# EAGLE design BMS MiniCAN Board Thermistor (EAGLE 7.6.0)
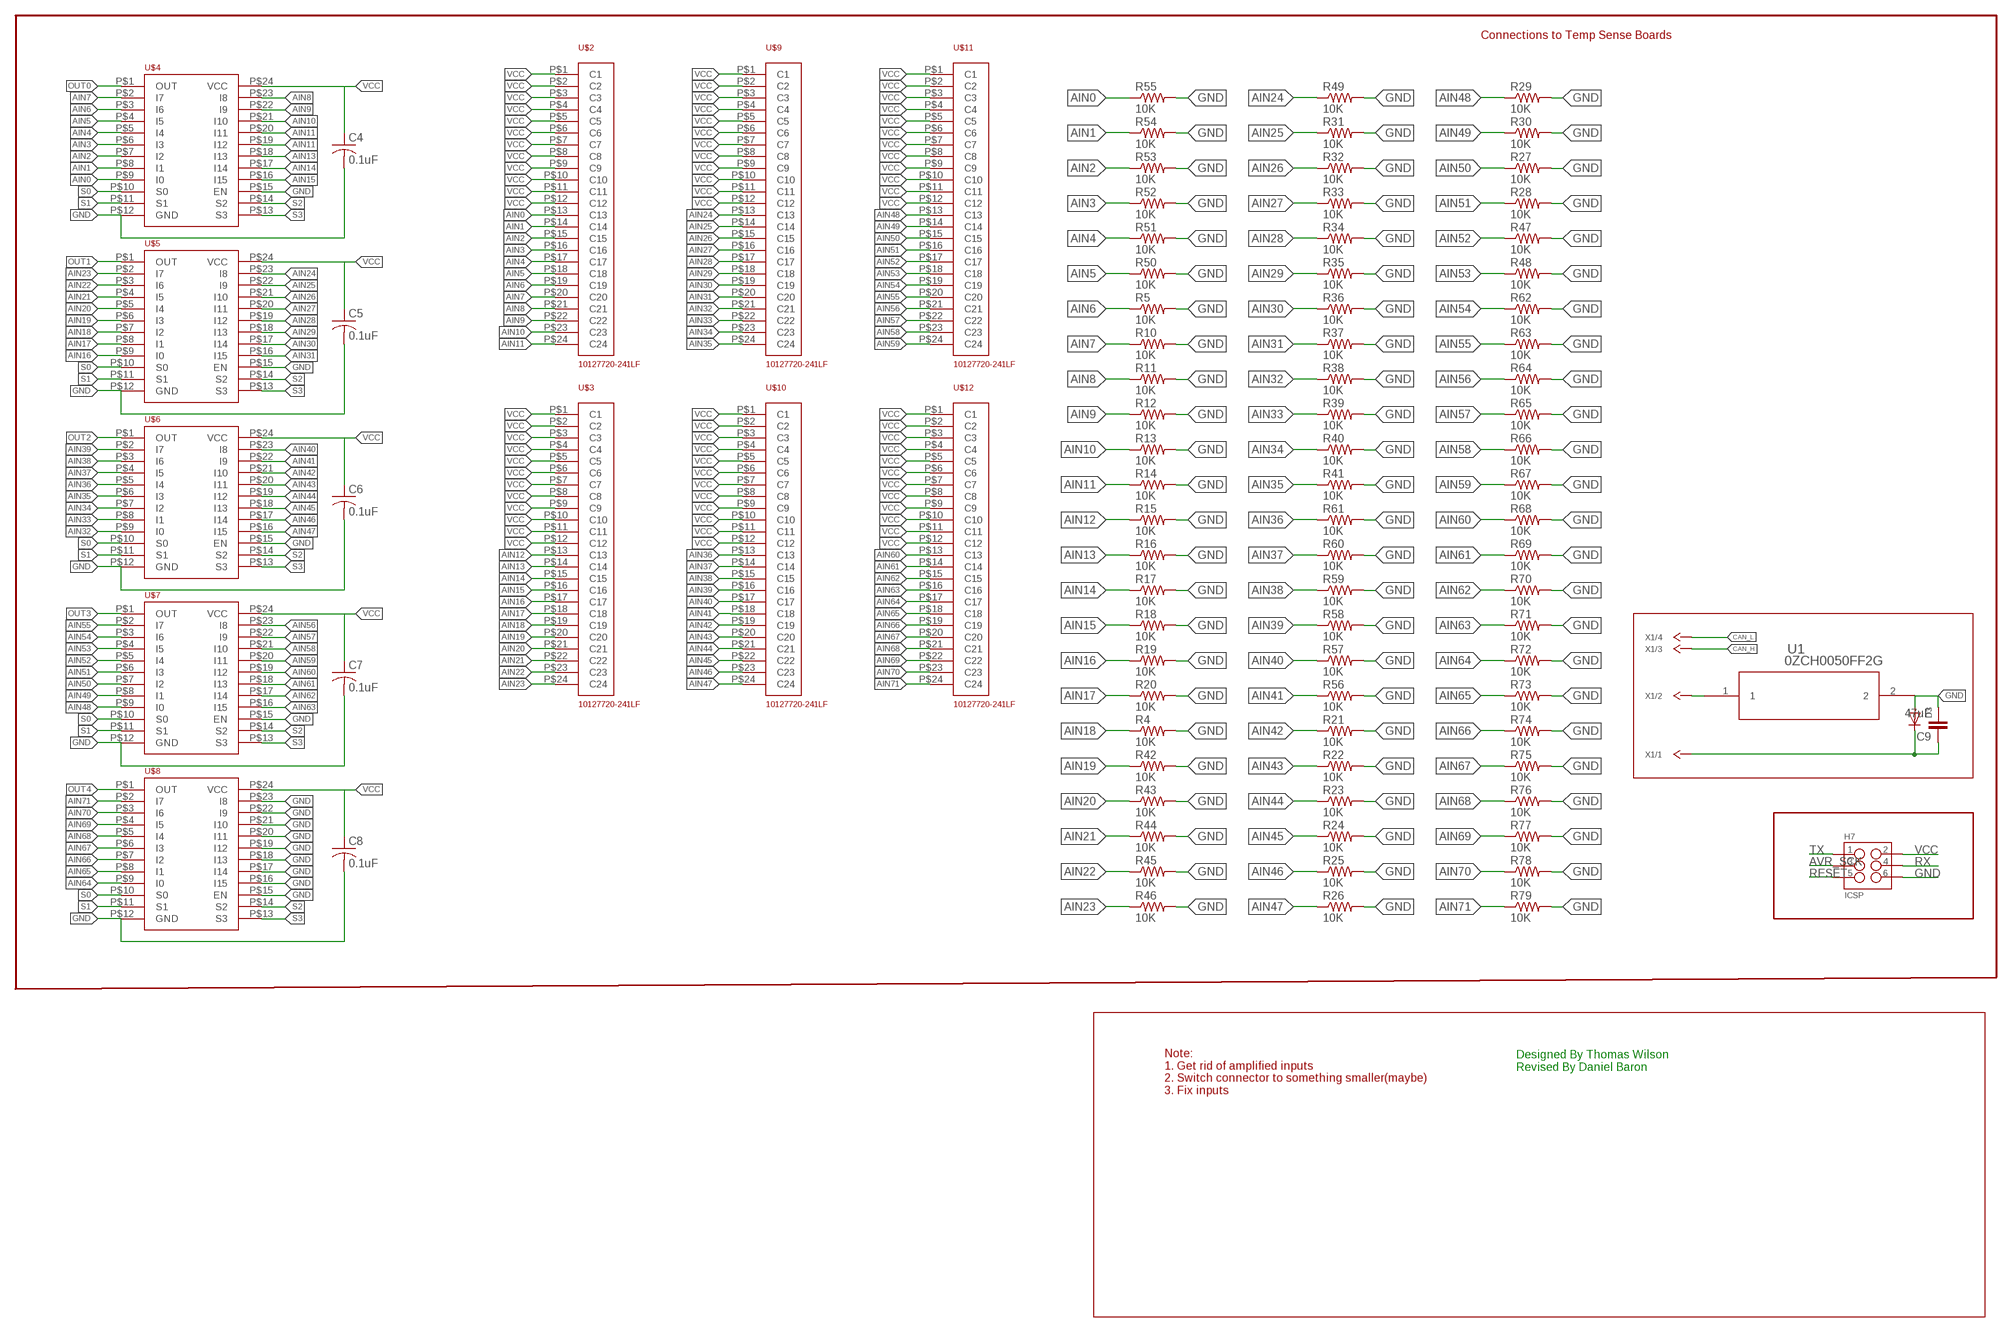
[diagram p0: schematic, sheet 1, part 1 of 2]
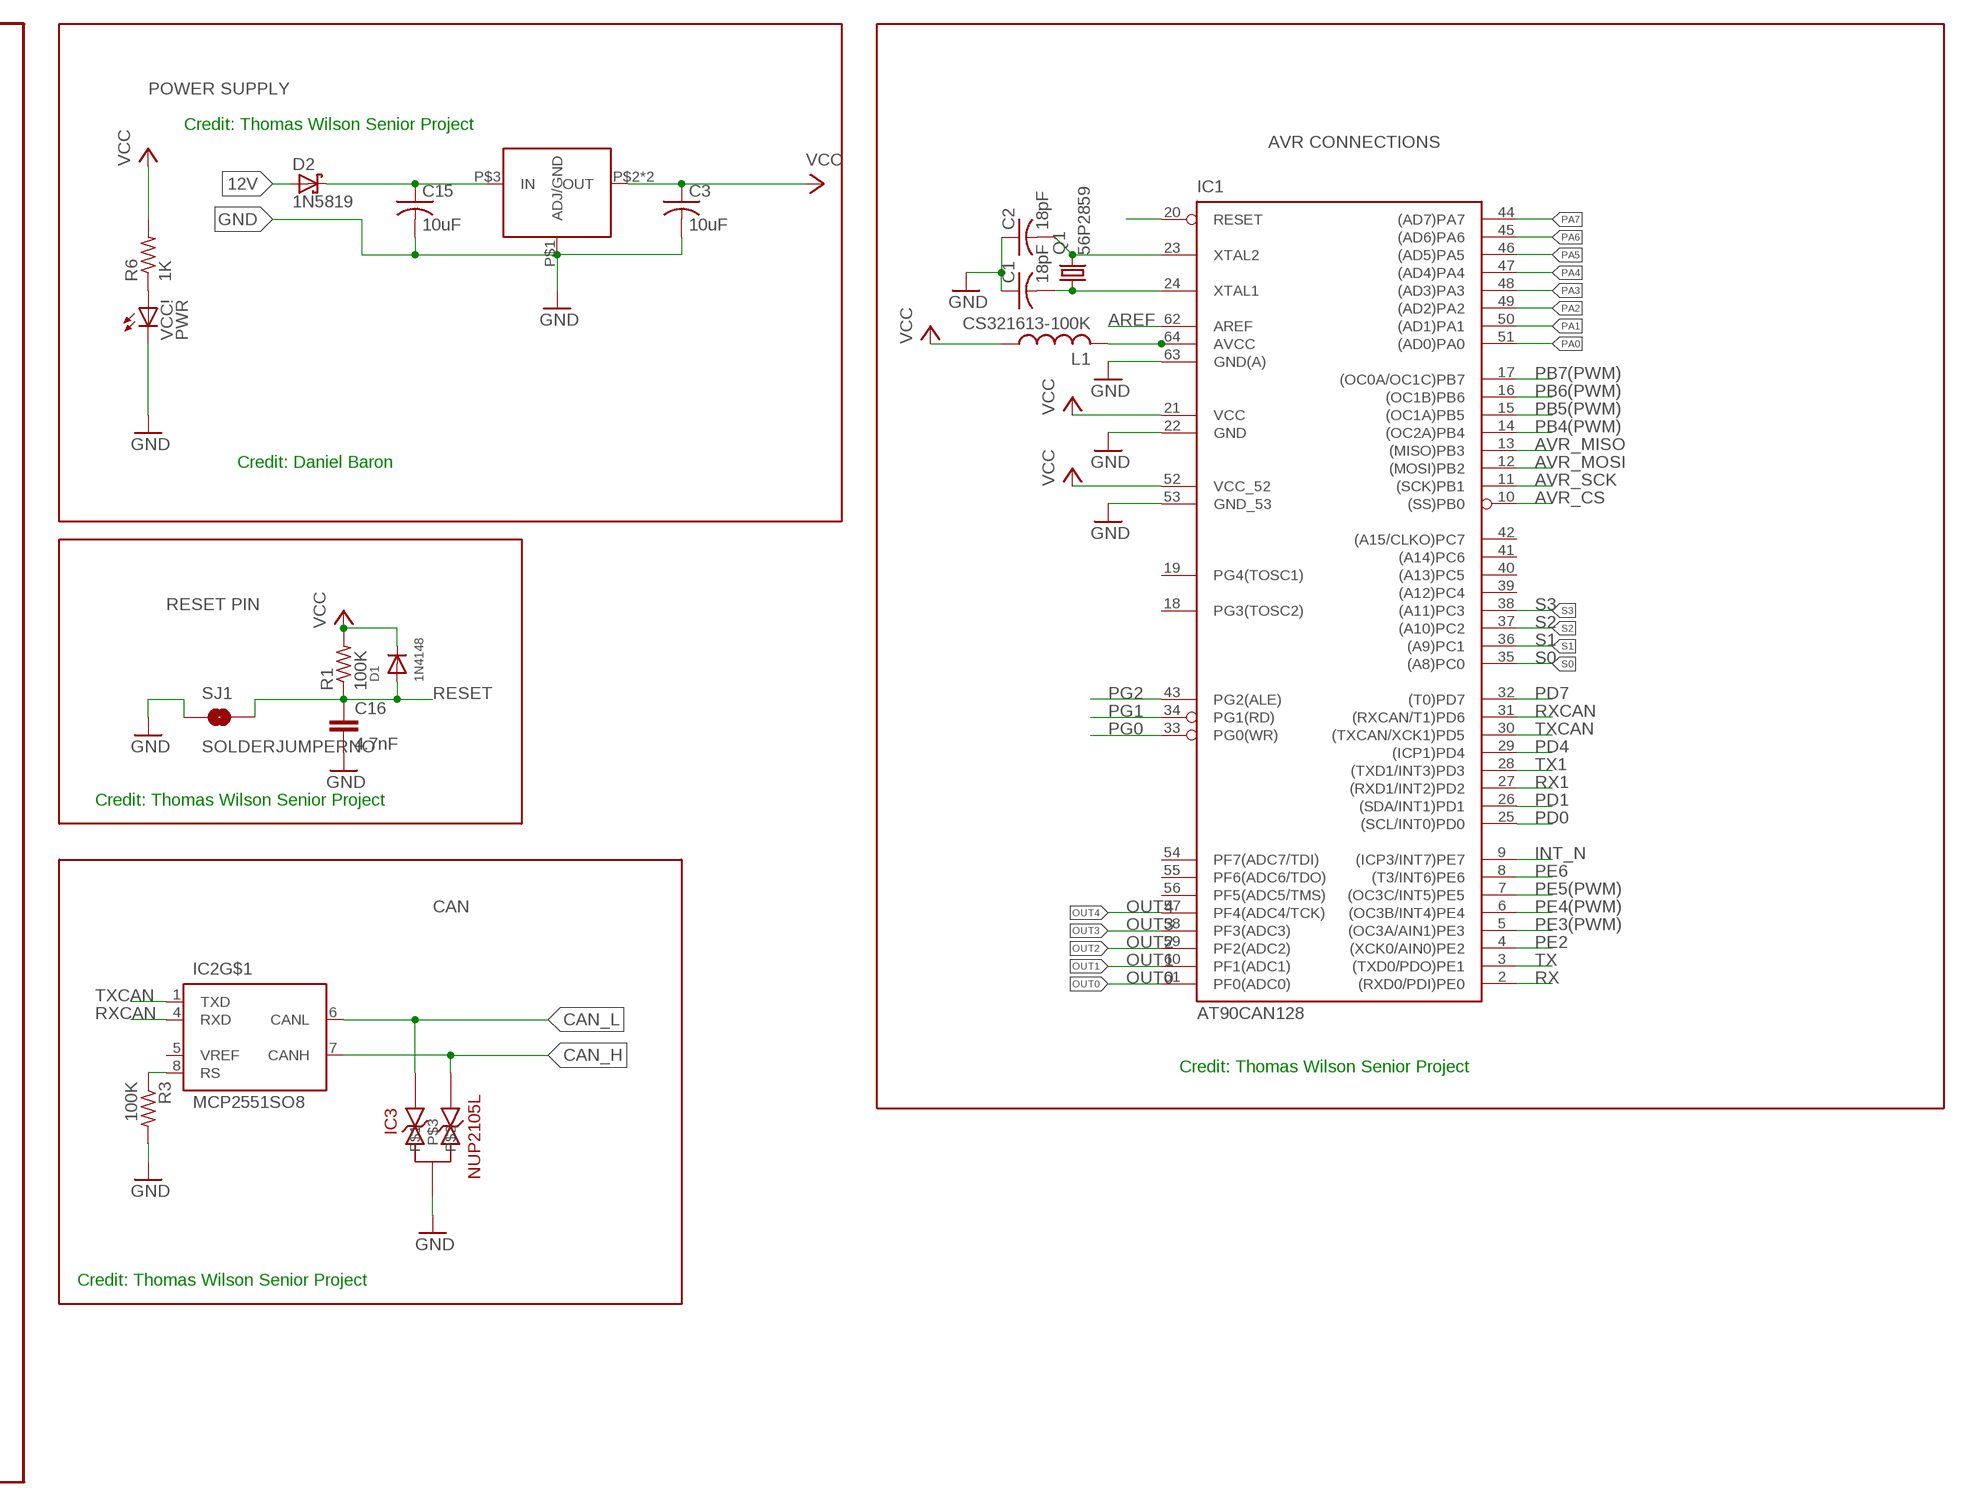
[diagram p1: schematic, sheet 1, part 2 of 2]

## Parts
C1  18pF  C-USC0805  [C0805]
C2  18pF  C-USC0805  [C0805]
C3  10uF  C-USC0805  [C0805]
C4  0.1uF  C-USC0805  [C0805]
C5  0.1uF  C-USC0805  [C0805]
C6  0.1uF  C-USC0805  [C0805]
C7  0.1uF  C-USC0805  [C0805]
C8  0.1uF  C-USC0805  [C0805]
C9  47uF  C-EUC0805  [C0805]
C15  10uF  C-USC0805  [C0805]
C16  4.7nF  CAP0603-CAP  [0603-CAP]
D1  1N4148  DIODESOD-123  [SOD-123]
D2  1N5819  1N5819-B  [DO41-7.6]
D3  DIODESOD-323F  [SOD-323F]
H7  ICSP  M03X2SMD_FCI  [2X3_SMD_FCI_54202-G30]
IC1  AT90CAN128  [TQFP64]
IC2  MCP2551SO8  [SO08]
IC3  NUP2105L  [SOT-23]
L1  CS321613-100K  L-USL3216C  [L3216C]
Q1  56P2859  CRYSTALSMD  [HC49UP]
R1  100K  R-US_R0805  [R0805]
R3  100K  R-US_R0805  [R0805]
R4  10K  R-US_R0603  [R0603]
R5  10K  R-US_R0603  [R0603]
R6  1K  R-US_R0805  [R0805]
R10  10K  R-US_R0603  [R0603]
R11  10K  R-US_R0603  [R0603]
R12  10K  R-US_R0603  [R0603]
R13  10K  R-US_R0603  [R0603]
R14  10K  R-US_R0603  [R0603]
R15  10K  R-US_R0603  [R0603]
R16  10K  R-US_R0603  [R0603]
R17  10K  R-US_R0603  [R0603]
R18  10K  R-US_R0603  [R0603]
R19  10K  R-US_R0603  [R0603]
R20  10K  R-US_R0603  [R0603]
R21  10K  R-US_R0603  [R0603]
R22  10K  R-US_R0603  [R0603]
R23  10K  R-US_R0603  [R0603]
R24  10K  R-US_R0603  [R0603]
R25  10K  R-US_R0603  [R0603]
R26  10K  R-US_R0603  [R0603]
R27  10K  R-US_R0603  [R0603]
R28  10K  R-US_R0603  [R0603]
R29  10K  R-US_R0603  [R0603]
R30  10K  R-US_R0603  [R0603]
R31  10K  R-US_R0603  [R0603]
R32  10K  R-US_R0603  [R0603]
R33  10K  R-US_R0603  [R0603]
R34  10K  R-US_R0603  [R0603]
R35  10K  R-US_R0603  [R0603]
R36  10K  R-US_R0603  [R0603]
R37  10K  R-US_R0603  [R0603]
R38  10K  R-US_R0603  [R0603]
R39  10K  R-US_R0603  [R0603]
R40  10K  R-US_R0603  [R0603]
R41  10K  R-US_R0603  [R0603]
R42  10K  R-US_R0603  [R0603]
R43  10K  R-US_R0603  [R0603]
R44  10K  R-US_R0603  [R0603]
R45  10K  R-US_R0603  [R0603]
R46  10K  R-US_R0603  [R0603]
R47  10K  R-US_R0603  [R0603]
R48  10K  R-US_R0603  [R0603]
R49  10K  R-US_R0603  [R0603]
R50  10K  R-US_R0603  [R0603]
R51  10K  R-US_R0603  [R0603]
R52  10K  R-US_R0603  [R0603]
R53  10K  R-US_R0603  [R0603]
R54  10K  R-US_R0603  [R0603]
R55  10K  R-US_R0603  [R0603]
R56  10K  R-US_R0603  [R0603]
R57  10K  R-US_R0603  [R0603]
R58  10K  R-US_R0603  [R0603]
R59  10K  R-US_R0603  [R0603]
R60  10K  R-US_R0603  [R0603]
R61  10K  R-US_R0603  [R0603]
R62  10K  R-US_R0603  [R0603]
R63  10K  R-US_R0603  [R0603]
R64  10K  R-US_R0603  [R0603]
R65  10K  R-US_R0603  [R0603]
R66  10K  R-US_R0603  [R0603]
R67  10K  R-US_R0603  [R0603]
R68  10K  R-US_R0603  [R0603]
R69  10K  R-US_R0603  [R0603]
R70  10K  R-US_R0603  [R0603]
R71  10K  R-US_R0603  [R0603]
R72  10K  R-US_R0603  [R0603]
R73  10K  R-US_R0603  [R0603]
R74  10K  R-US_R0603  [R0603]
R75  10K  R-US_R0603  [R0603]
R76  10K  R-US_R0603  [R0603]
R77  10K  R-US_R0603  [R0603]
R78  10K  R-US_R0603  [R0603]
R79  10K  R-US_R0603  [R0603]
SJ1  SOLDERJUMPERNO  [SJ_2S-NO]
U1  0ZCH0050FF2G  [0ZCH]
U$1  LM117MPX-5.0  [SOT223-4]
U$2  10127720-241LF  [10127720-241LF]
U$3  10127720-241LF  [10127720-241LF]
U$4  CD74HC4067  [24-SOIC]
U$5  CD74HC4067  [24-SOIC]
U$6  CD74HC4067  [24-SOIC]
U$7  CD74HC4067  [24-SOIC]
U$8  CD74HC4067  [24-SOIC]
U$9  10127720-241LF  [10127720-241LF]
U$10  10127720-241LF  [10127720-241LF]
U$11  10127720-241LF  [10127720-241LF]
U$12  10127720-241LF  [10127720-241LF]
VCC!  PWR  LEDCHIPLED_0805  [CHIPLED_0805]
X1  4_PIN_CONN  [4_PIN_MOLEX]

## Nets
12V: C9.1 D2.A D3.C X1.P$1
AIN0: R55.1 U$2.P$13(C13) U$4.P$9(I0)
AIN1: R54.1 U$2.P$14(C14) U$4.P$8(I1)
AIN2: R53.1 U$2.P$15(C15) U$4.P$7(I2)
AIN3: R52.1 U$2.P$16(C16) U$4.P$6(I3)
AIN4: R51.1 U$2.P$17(C17) U$4.P$5(I4)
AIN5: R50.1 U$2.P$18(C18) U$4.P$4(I5)
AIN6: R5.1 U$2.P$19(C19) U$4.P$3(I6)
AIN7: R10.1 U$2.P$20(C20) U$4.P$2(I7)
AIN8: R11.1 U$2.P$21(C21) U$4.P$23(I8)
AIN9: R12.1 U$2.P$22(C22) U$4.P$22(I9)
AIN10: R13.1 U$2.P$23(C23) U$4.P$21(I10)
AIN11: R14.1 U$2.P$24(C24) U$4.P$19(I12) U$4.P$20(I11)
AIN12: R15.1 U$3.P$13(C13)
AIN13: R16.1 U$3.P$14(C14) U$4.P$18(I13)
AIN14: R17.1 U$3.P$15(C15) U$4.P$17(I14)
AIN15: R18.1 U$3.P$16(C16) U$4.P$16(I15)
AIN16: R19.1 U$3.P$17(C17) U$5.P$9(I0)
AIN17: R20.1 U$3.P$18(C18) U$5.P$8(I1)
AIN18: R4.1 U$3.P$19(C19) U$5.P$7(I2)
AIN19: R42.1 U$3.P$20(C20) U$5.P$6(I3)
AIN20: R43.1 U$3.P$21(C21) U$5.P$5(I4)
AIN21: R44.1 U$3.P$22(C22) U$5.P$4(I5)
AIN22: R45.1 U$3.P$23(C23) U$5.P$3(I6)
AIN23: R46.1 U$3.P$24(C24) U$5.P$2(I7)
AIN24: R49.1 U$5.P$23(I8) U$9.P$13(C13)
AIN25: R31.1 U$5.P$22(I9) U$9.P$14(C14)
AIN26: R32.1 U$5.P$21(I10) U$9.P$15(C15)
AIN27: R33.1 U$5.P$20(I11) U$9.P$16(C16)
AIN28: R34.1 U$5.P$19(I12) U$9.P$17(C17)
AIN29: R35.1 U$5.P$18(I13) U$9.P$18(C18)
AIN30: R36.1 U$5.P$17(I14) U$9.P$19(C19)
AIN31: R37.1 U$5.P$16(I15) U$9.P$20(C20)
AIN32: R38.1 U$6.P$9(I0) U$9.P$21(C21)
AIN33: R39.1 U$6.P$8(I1) U$9.P$22(C22)
AIN34: R40.1 U$6.P$7(I2) U$9.P$23(C23)
AIN35: R41.1 U$6.P$6(I3) U$9.P$24(C24)
AIN36: R61.1 U$6.P$5(I4) U$10.P$13(C13)
AIN37: R60.1 U$6.P$4(I5) U$10.P$14(C14)
AIN38: R59.1 U$6.P$3(I6) U$10.P$15(C15)
AIN39: R58.1 U$6.P$2(I7) U$10.P$16(C16)
AIN40: R57.1 U$6.P$23(I8) U$10.P$17(C17)
AIN41: R56.1 U$6.P$22(I9) U$10.P$18(C18)
AIN42: R21.1 U$6.P$21(I10) U$10.P$19(C19)
AIN43: R22.1 U$6.P$20(I11) U$10.P$20(C20)
AIN44: R23.1 U$6.P$19(I12) U$10.P$21(C21)
AIN45: R24.1 U$6.P$18(I13) U$10.P$22(C22)
AIN46: R25.1 U$6.P$17(I14) U$10.P$23(C23)
AIN47: R26.1 U$6.P$16(I15) U$10.P$24(C24)
AIN48: R29.1 U$7.P$9(I0) U$11.P$13(C13)
AIN49: R30.1 U$7.P$8(I1) U$11.P$14(C14)
AIN50: R27.1 U$7.P$7(I2) U$11.P$15(C15)
AIN51: R28.1 U$7.P$6(I3) U$11.P$16(C16)
AIN52: R47.1 U$7.P$5(I4) U$11.P$17(C17)
AIN53: R48.1 U$7.P$4(I5) U$11.P$18(C18)
AIN54: R62.1 U$7.P$3(I6) U$11.P$19(C19)
AIN55: R63.1 U$7.P$2(I7) U$11.P$20(C20)
AIN56: R64.1 U$7.P$23(I8) U$11.P$21(C21)
AIN57: R65.1 U$7.P$22(I9) U$11.P$22(C22)
AIN58: R66.1 U$7.P$21(I10) U$11.P$23(C23)
AIN59: R67.1 U$7.P$20(I11) U$11.P$24(C24)
AIN60: R68.1 U$7.P$19(I12) U$12.P$13(C13)
AIN61: R69.1 U$7.P$18(I13) U$12.P$14(C14)
AIN62: R70.1 U$7.P$17(I14) U$12.P$15(C15)
AIN63: R71.1 U$7.P$16(I15) U$12.P$16(C16)
AIN64: R72.1 U$8.P$9(I0) U$12.P$17(C17)
AIN65: R73.1 U$8.P$8(I1) U$12.P$18(C18)
AIN66: R74.1 U$8.P$7(I2) U$12.P$19(C19)
AIN67: R75.1 U$8.P$6(I3) U$12.P$20(C20)
AIN68: R76.1 U$8.P$5(I4) U$12.P$21(C21)
AIN69: R77.1 U$8.P$4(I5) U$12.P$22(C22)
AIN70: R78.1 U$8.P$3(I6) U$12.P$23(C23)
AIN71: R79.1 U$8.P$2(I7) U$12.P$24(C24)
AREF: IC1.62(AREF)
AVR_CS: IC1.10((SS)PB0)
AVR_MISO: IC1.13((MISO)PB3)
AVR_MOSI: IC1.12((MOSI)PB2)
AVR_SCK: H7.3 IC1.11((SCK)PB1)
CAN_H: IC2.7(CANH) IC3.2 X1.P$3
CAN_L: IC2.6(CANL) IC3.1 X1.P$4
GND: C1.1 C2.1 C3.2 C4.2 C5.2 C6.2 C7.2 C8.2 C9.2 C15.2 C16.2 D3.A H7.6 IC1.22(GND) IC1.53(GND_53) IC1.63(GND(A)) IC3.3 R3.2 R4.2 R5.2 R10.2 R11.2 R12.2 R13.2 R14.2 R15.2 R16.2 R17.2 R18.2 R19.2 R20.2 R21.2 R22.2 R23.2 R24.2 R25.2 R26.2 R27.2 R28.2 R29.2 R30.2 R31.2 R32.2 R33.2 R34.2 R35.2 R36.2 R37.2 R38.2 R39.2 R40.2 R41.2 R42.2 R43.2 R44.2 R45.2 R46.2 R47.2 R48.2 R49.2 R50.2 R51.2 R52.2 R53.2 R54.2 R55.2 R56.2 R57.2 R58.2 R59.2 R60.2 R61.2 R62.2 R63.2 R64.2 R65.2 R66.2 R67.2 R68.2 R69.2 R70.2 R71.2 R72.2 R73.2 R74.2 R75.2 R76.2 R77.2 R78.2 R79.2 SJ1.1 U1.2 U$1.P$1(ADJ/GND) U$4.P$12(GND) U$4.P$15(EN) U$5.P$12(GND) U$5.P$15(EN) U$6.P$12(GND) U$6.P$15(EN) U$7.P$12(GND) U$7.P$15(EN) U$8.P$12(GND) U$8.P$15(EN) U$8.P$16(I15) U$8.P$17(I14) U$8.P$18(I13) U$8.P$19(I12) U$8.P$20(I11) U$8.P$21(I10) U$8.P$22(I9) U$8.P$23(I8) VCC!.C
INT_N: IC1.9((ICP3/INT7)PE7)
N$1: C15.1 D2.C U$1.P$3(IN)
N$2: U1.1 X1.P$2
N$6: IC2.8(RS) R3.1
N$9: R6.1 VCC!.A
N$11: C1.2 IC1.24(XTAL1) Q1.1
N$22: IC1.64(AVCC) L1.2
OUT0: IC1.61(PF0(ADC0)) U$4.P$1(OUT)
OUT1: IC1.60(PF1(ADC1)) U$5.P$1(OUT)
OUT2: IC1.59(PF2(ADC2)) U$6.P$1(OUT)
OUT3: IC1.58(PF3(ADC3)) U$7.P$1(OUT)
OUT4: IC1.57(PF4(ADC4/TCK)) U$8.P$1(OUT)
PA0: IC1.51((AD0)PA0)
PA1: IC1.50((AD1)PA1)
PA2: IC1.49((AD2)PA2)
PA3: IC1.48((AD3)PA3)
PA4: IC1.47((AD4)PA4)
PA5: IC1.46((AD5)PA5)
PA6: IC1.45((AD6)PA6)
PA7: IC1.44((AD7)PA7)
PB4(PWM): IC1.14((OC2A)PB4)
PB5(PWM): IC1.15((OC1A)PB5)
PB6(PWM): IC1.16((OC1B)PB6)
PB7(PWM): IC1.17((OC0A/OC1C)PB7)
PD0: IC1.25((SCL/INT0)PD0)
PD1: IC1.26((SDA/INT1)PD1)
PD4: IC1.29((ICP1)PD4)
PD7: IC1.32((T0)PD7)
PE2: IC1.4((XCK0/AIN0)PE2)
PE3(PWM): IC1.5((OC3A/AIN1)PE3)
PE4(PWM): IC1.6((OC3B/INT4)PE4)
PE5(PWM): IC1.7((OC3C/INT5)PE5)
PE6: IC1.8((T3/INT6)PE6)
PG0: IC1.33(PG0(WR))
PG1: IC1.34(PG1(RD))
PG2: IC1.43(PG2(ALE))
RESET: C16.1 D1.A H7.5 IC1.20(RESET) R1.1 SJ1.2
RX: H7.4 IC1.2((RXD0/PDI)PE0)
RX1: IC1.27((RXD1/INT2)PD2)
RXCAN: IC1.31((RXCAN/T1)PD6) IC2.4(RXD)
S0: IC1.35((A8)PC0) U$4.P$10(S0) U$5.P$10(S0) U$6.P$10(S0) U$7.P$10(S0) U$8.P$10(S0)
S1: IC1.36((A9)PC1) U$4.P$11(S1) U$5.P$11(S1) U$6.P$11(S1) U$7.P$11(S1) U$8.P$11(S1)
S2: IC1.37((A10)PC2) U$4.P$14(S2) U$5.P$14(S2) U$6.P$14(S2) U$7.P$14(S2) U$8.P$14(S2)
S3: IC1.38((A11)PC3) U$4.P$13(S3) U$5.P$13(S3) U$6.P$13(S3) U$7.P$13(S3) U$8.P$13(S3)
TX: H7.1 IC1.3((TXD0/PDO)PE1)
TX1: IC1.28((TXD1/INT3)PD3)
TXCAN: IC1.30((TXCAN/XCK1)PD5) IC2.1(TXD)
VCC: C3.1 C4.1 C5.1 C6.1 C7.1 C8.1 D1.C H7.2 IC1.21(VCC) IC1.52(VCC_52) L1.1 R1.2 R6.2 U$1.P$2(OUT) U$1.P$4(OUT) U$2.P$1(C1) U$2.P$2(C2) U$2.P$3(C3) U$2.P$4(C4) U$2.P$5(C5) U$2.P$6(C6) U$2.P$7(C7) U$2.P$8(C8) U$2.P$9(C9) U$2.P$10(C10) U$2.P$11(C11) U$2.P$12(C12) U$3.P$1(C1) U$3.P$2(C2) U$3.P$3(C3) U$3.P$4(C4) U$3.P$5(C5) U$3.P$6(C6) U$3.P$7(C7) U$3.P$8(C8) U$3.P$9(C9) U$3.P$10(C10) U$3.P$11(C11) U$3.P$12(C12) U$4.P$24(VCC) U$9.P$1(C1) U$9.P$2(C2) U$9.P$3(C3) U$9.P$4(C4) U$9.P$5(C5) U$9.P$6(C6) U$9.P$7(C7) U$9.P$8(C8) U$9.P$9(C9) U$9.P$10(C10) U$9.P$11(C11) U$9.P$12(C12) U$10.P$1(C1) U$10.P$2(C2) U$10.P$3(C3) U$10.P$4(C4) U$10.P$5(C5) U$10.P$6(C6) U$10.P$7(C7) U$10.P$8(C8) U$10.P$9(C9) U$10.P$10(C10) U$10.P$11(C11) U$10.P$12(C12) U$11.P$1(C1) U$11.P$2(C2) U$11.P$3(C3) U$11.P$4(C4) U$11.P$5(C5) U$11.P$6(C6) U$11.P$7(C7) U$11.P$8(C8) U$11.P$9(C9) U$11.P$10(C10) U$11.P$11(C11) U$11.P$12(C12) U$12.P$1(C1) U$12.P$2(C2) U$12.P$3(C3) U$12.P$4(C4) U$12.P$5(C5) U$12.P$6(C6) U$12.P$7(C7) U$12.P$8(C8) U$12.P$9(C9) U$12.P$10(C10) U$12.P$11(C11) U$12.P$12(C12)
XTAL1: C2.2 IC1.23(XTAL2) Q1.2
Unconnected: IC1.18(PG3(TOSC2)) IC1.19(PG4(TOSC1)) IC1.39((A12)PC4) IC1.40((A13)PC5) IC1.41((A14)PC6) IC1.42((A15/CLKO)PC7) IC1.54(PF7(ADC7/TDI)) IC1.55(PF6(ADC6/TDO)) IC1.56(PF5(ADC5/TMS)) IC2.5(VREF) U$5.P$24(VCC) U$6.P$24(VCC) U$7.P$24(VCC) U$8.P$24(VCC)

## Notes on the sheet
- Connections to Temp Sense Boards
- POWER SUPPLY
- Credit: Thomas Wilson Senior Project
- AVR CONNECTIONS
- Credit: Daniel Baron
- RESET PIN
- Credit: Thomas Wilson Senior Project
- CAN
- Credit: Thomas Wilson Senior Project
- Credit: Thomas Wilson Senior Project
- Designed By Thomas Wilson
  Revised By Daniel Baron
- Note:
  1. Get rid of amplified inputs
  2. Switch connector to something smaller(maybe)
  3. Fix inputs

## Power pins joined to a net without a drawn wire
GND: IC2.2(GND)
VCC: IC2.3(VCC)

## Library data of the parts
C1 C2 C4-C8 = rcl:C-US: CAPACITOR, American symbol
C3 C15 = resistor:C-US: CAPACITOR, American symbol
C9 = rcl:C-EU: CAPACITOR, European symbol
C16 = SparkFun-Capacitors:CAP: Capacitor Standard 0603 ceramic capacitor, and 0.1" leaded capacitor.
D1 D3 = adafruit:DIODE: Diode SMADIODE - SMA Surface Mount Package 20V 1A Schottky Diode Digikey: 641-1014-6-ND DO-1N4148 - Through Hole Small Current Diode SOD-123 20V 1 A (.5mV Vf) Schottky Diode - Digikey: MBRX120TPMSCT-ND SOD-323 10V 570mA (.38mV Vf, 3ns) Schottky Diode - Digikey: ZLLS410CT-ND SOD-523 30V 30mA Schottky Diode (RB751S-40TE61) - Digikey: RB751S-40TE61CT-ND SOT23-R/W - SOT23 Package (R = Solder Paste/Reflow Ovens, W = Hand-Soldering) BAT54Film 40V 300mA - Digikey: 497-7162-1-ND
D2 = diode:1N581*: 1.0A SCHOTTKY BARRIER RECTIFIER Source: http://www.diodes.com/datasheets/ds23001.pdf
H7 = SparkFun-Connectors:M03X2: 2x3 .1" header. Shrouded, with keying- CONN-10681 SMT- CONN-11415 Pogo pins- HW-11044
IC1 = at90can128:AT90CAN128
IC2 = can:MCP2551: CAN Tranceiver Microchip
IC3 = Artificial Science:NUP2105L
L1 = rcl:L-US: INDUCTOR, American symbol
Q1 = SparkFun-FreqCtrl:CRYSTAL: Various standard crystals. Proven footprints. Spark Fun Electronics SKU : COM-00534
R1 R3 R6 = rcl:R-US_: RESISTOR, American symbol
R4 R5 R10-R79 = adafruit:R-US_: RESISTOR, American symbol
SJ1 = SparkFun-Passives:SOLDERJUMPER: Solder Jumper Standard SMD solder jumper. Used to automate production. Two varients : Normally Open and Normally Closed are the same, but have different paste layers. NC will have a large amount of paste and should jumper during reflow.
U1 = BMS Lbr:0ZCH0050FF2G; COPYRIGHT: Copyright (C) 2016 Accelerated Designs. All rights reserved; MANUFACTURER_PART_NUMBER: 0ZCH0050FF2G; VENDOR: Belfuse
U$1 = BMS Lbr:LM117MPX-5.0: 5V fixed voltage regulator, 1%
U$2 U$3 U$9-U$12 = con-amphenol:10127720-241LF: 24 Positions Plug Connector 0.118" (3.00mm) Through Hole, Right Angle Tin
U$4-U$8 = BMS Lbr:CD74HC4067: High-Speed CMOS Logic 16-Channel Analog Multiplexer/Demultiplexer
VCC! = led:LED: LED OSRAM: - CHIPLED LG R971, LG N971, LY N971, LG Q971, LY Q971, LO R971, LY R971 LH N974, LH R974 LS Q976, LO Q976, LY Q976 LO Q996 - Hyper CHIPLED LW Q18S LB Q993, LB Q99A, LB R99A - SideLED LS A670, LO A670, LY A670, LG A670, LP A670 LB A673, LV A673, LT A673, LW A673 LH A674 LY A675 LS A676, LA A676, LO A676, LY A676, LW A676 LS A679, LY A679, LG A679 - Hyper Micro SIDELED® LS Y876, LA Y876, LO Y876, LY Y876 LT Y87S - SmartLED LW L88C, LW L88S LB L89C, LB L89S, LG L890 LS L89K, LO L89K, LY L89K LS L896, LA L896, LO L896, LY L896 - TOPLED LS T670, LO T670, LY T670, LG T670, LP T670 LSG T670, LSP T670, LSY T670, LOP T670, LYG T670 LG T671, LOG T671, LSG T671 LB T673, LV T673, LT T673, LW T673 LH T674 LS T676, LA T676, LO T676, LY T676, LB T676, LH T676, LSB T676, LW T676 LB T67C, LV T67C, LT T67C, LS T67K, LO T67K, LY T67K, LW E67C LS E67B, LA E67B, LO E67B, LY E67B, LB E67C, LV E67C, LT E67C LW T67C LS T679, LY T679, LG T679 LS T770, LO T770, LY T770, LG T770, LP T770 LB T773, LV T773, LT T773, LW T773 LH T774 LS E675, LA E675, LY E675, LS T675 LS T776, LA T776, LO T776, LY T776, LB T776 LHGB T686 LT T68C, LB T68C - Hyper Mini TOPLED® LB M676 - Mini TOPLED Santana® LG M470 LS M47K, LO M47K, LY M47K Source: http://www.osram.convergy.de LUXEON: - LUMILED® LXK2-PW12-R00, LXK2-PW12-S00, LXK2-PW14-U00, LXK2-PW14-V00 LXK2-PM12-R00, LXK2-PM12-S00, LXK2-PM14-U00 LXK2-PE12-Q00, LXK2-PE12-R00, LXK2-PE12-S00, LXK2-PE14-T00, LXK2-PE14-U00 LXK2-PB12-K00, LXK2-PB12-L00, LXK2-PB12-M00, LXK2-PB14-N00, LXK2-PB14-P00, LXK2-PB14-Q00 LXK2-PR12-L00, LXK2-PR12-M00, LXK2-PR14-Q00, LXK2-PR14-R00 LXK2-PD12-Q00, LXK2-PD12-R00, LXK2-PD12-S00 LXK2-PH12-R00, LXK2-PH12-S00 LXK2-PL12-P00, LXK2-PL12-Q00, LXK2-PL12-R00 Source: www.luxeon.com KINGBRIGHT: KA-3528ASYC Source: www.kingbright.com
X1 = BMS Lbr:4_PIN_CONN

## Board
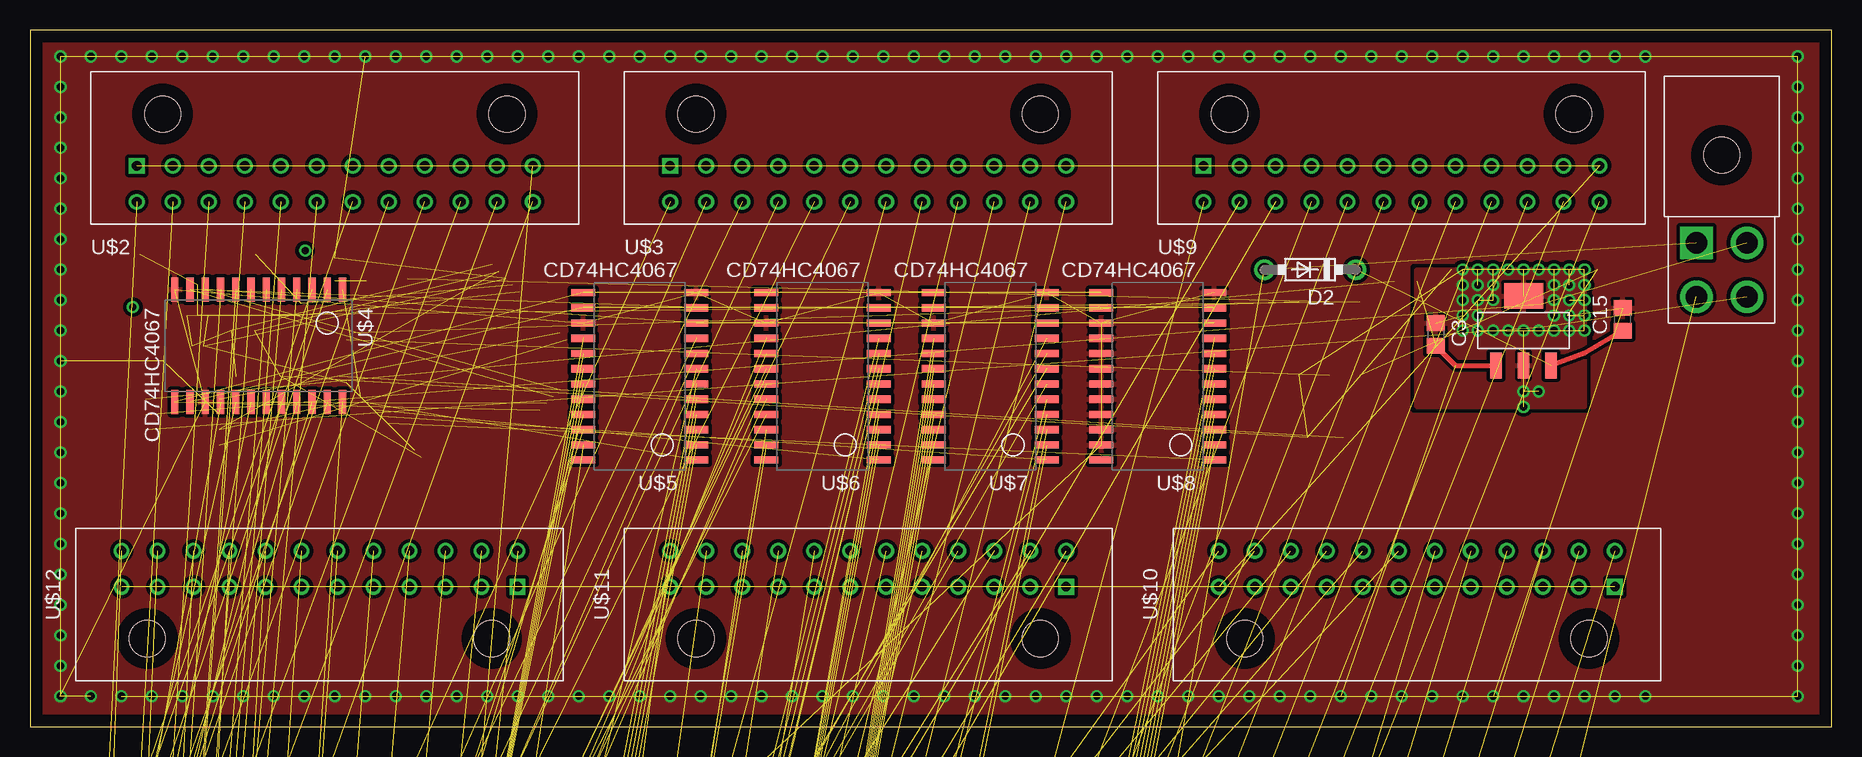
[diagram p2: board, top side]
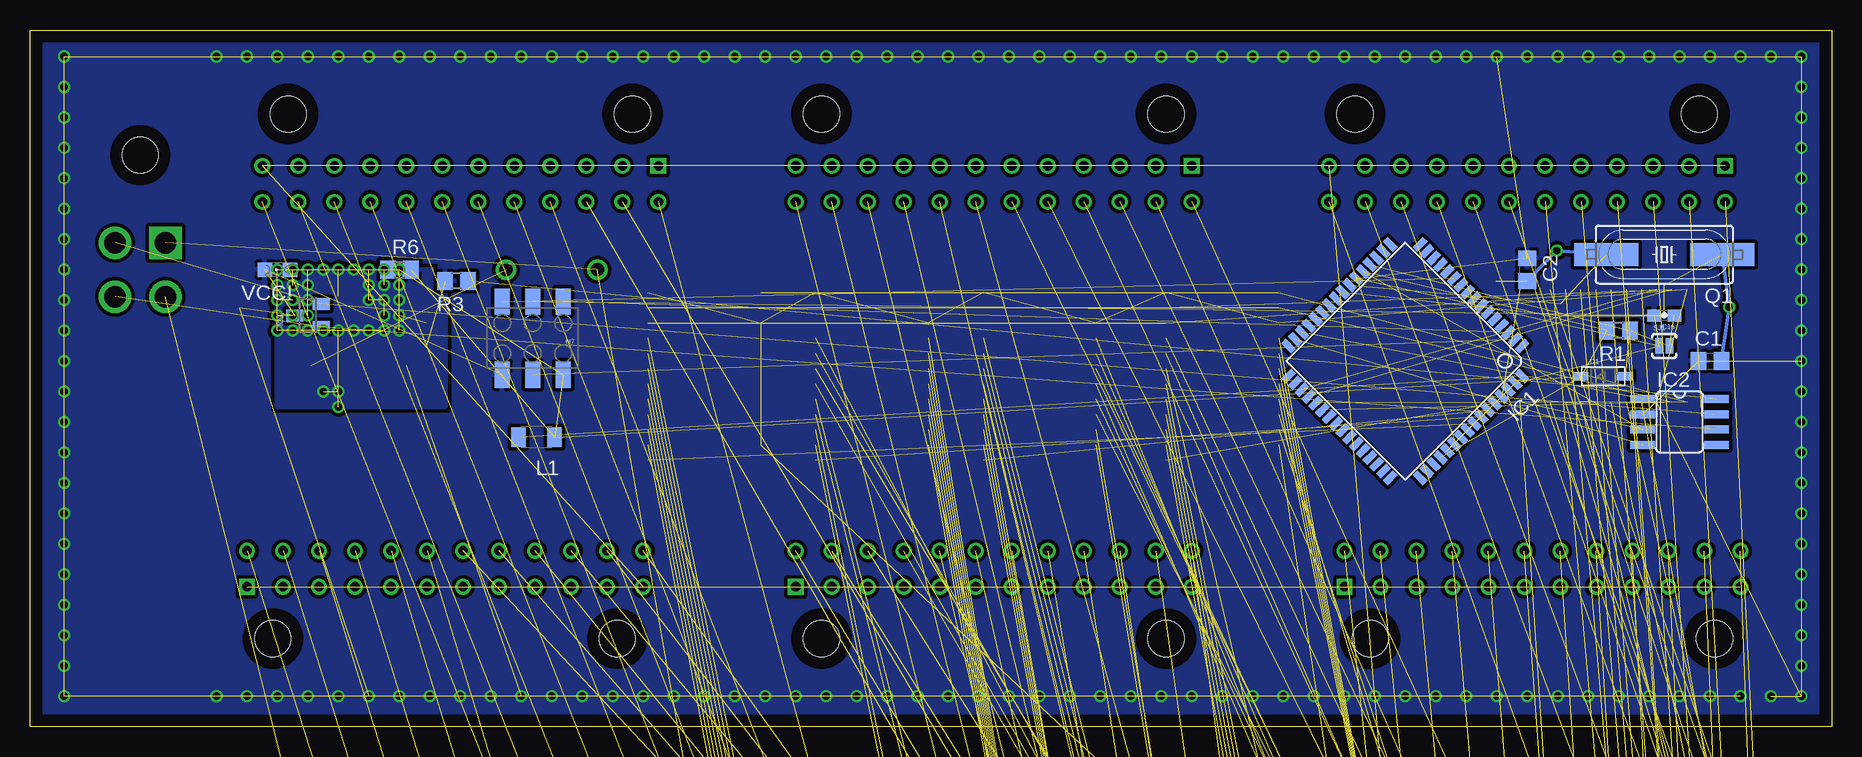
[diagram p3: board, bottom side, seen from below]

Size 150.16 x 58.09 mm. Coordinates in mm from the lower left corner, seen from the top.
Outline: 0,0 150.16,0 150.16,58.09 0,58.09 0,0
Copper layers (1*16): Top 0.035mm / dielectric 1.5mm / Bottom 0.035mm
Design rules "default": minimum track width 10mil, minimum drill 24mil, track to track 8mil, track to pad 8mil, pad to pad 8mil, via to via 8mil, smd to smd 8mil, copper to edge 40mil, drill to drill 8mil, minimum pad ring 10mil, minimum via ring 8mil, stop-mask expansion 4mil, vias tented up to drill 0mil, thermal gap 10mil

### Footprints (pad centres in the part's own frame; a part is rotated, then mirrored left to right if it is on the bottom)
C0805 = smd 1.3 x 1.5: 1 -0.95,0; 2 0.95,0
0603-CAP = smd 1.1 x 1: 1 -0.85,0; 2 0.85,0
SOD-123 = smd 1.2 x 0.7: A 1.85,0; C -1.85,0
DO41-7.6 = drill 1.1 pad 1.7: A 3.81,0; C -3.81,0
SOD-323F = smd 1 x 0.8: A -1,0; C 1,0
2X3_SMD_FCI_54202-G30 = smd 1.27 x 2.18: 1 -2.54,-3.05; 2 -2.54,3.05; 3 0,-3.05; 4 0,3.05; 5 2.54,-3.05; 6 2.54,3.05
TQFP64 = smd 1.194 x 0.559: 1 -7.76,6; 2 -7.76,5.2; 3 -7.76,4.4; 4 -7.76,3.6; 5 -7.76,2.8; 6 -7.76,2; 7 -7.76,1.2; 8 -7.76,0.4; 9 -7.76,-0.4; 10 -7.76,-1.2; 11 -7.76,-2; 12 -7.76,-2.8; 13 -7.76,-3.6; 14 -7.76,-4.4; 15 -7.76,-5.2; 16 -7.76,-6; 33 7.76,-6; 34 7.76,-5.2; 35 7.76,-4.4; 36 7.76,-3.6; 37 7.76,-2.8; 38 7.76,-2; 39 7.76,-1.2; 40 7.76,-0.4; 41 7.76,0.4; 42 7.76,1.2; 43 7.76,2; 44 7.76,2.8; 45 7.76,3.6; 46 7.76,4.4; 47 7.76,5.2; 48 7.76,6 | smd 0.559 x 1.194: 17 -6,-7.76; 18 -5.2,-7.76; 19 -4.4,-7.76; 20 -3.6,-7.76; 21 -2.8,-7.76; 22 -2,-7.76; 23 -1.2,-7.76; 24 -0.4,-7.76; 25 0.4,-7.76; 26 1.2,-7.76; 27 2,-7.76; 28 2.8,-7.76; 29 3.6,-7.76; 30 4.4,-7.76; 31 5.2,-7.76; 32 6,-7.76; 49 6,7.76; 50 5.2,7.76; 51 4.4,7.76; 52 3.6,7.76; 53 2.8,7.76; 54 2,7.76; 55 1.2,7.76; 56 0.4,7.76; 57 -0.4,7.76; 58 -1.2,7.76; 59 -2,7.76; 60 -2.8,7.76; 61 -3.6,7.76; 62 -4.4,7.76; 63 -5.2,7.76; 64 -6,7.76
SO08 = smd 0.66 x 2.032: 1 -1.905,-3.073; 2 -0.635,-3.073; 3 0.635,-3.073; 4 1.905,-3.073; 5 1.905,3.073; 6 0.635,3.073; 7 -0.635,3.073; 8 -1.905,3.073
SOT-23 = smd 1 x 1.4: 1 -0.95,-1.1; 2 0.95,-1.1; 3 0,1.1
L3216C = smd 1.2 x 1.6: 1 -1.5,0; 2 1.5,0
HC49UP = smd 5.334 x 1.93: 1 -4.826,0; 2 4.826,0
R0805 = smd 1.3 x 1.5: 1 -0.95,0; 2 0.95,0
R0603 = smd 1 x 1.1: 1 -0.85,0; 2 0.85,0
SJ_2S-NO = smd 0.635 x 1.27: 1 -0.45,0; 2 0.45,0
0ZCH = smd 0.991 x 2.794: 1 -1.499,0; 2 1.499,0
SOT223-4 = smd 0.95 x 2.15: P$1 -2.3,-2.9; P$2 0,-2.9; P$3 2.3,-2.9 | smd 3.25 x 2.15: P$4 0,2.9
10127720-241LF = drill 0.8 pad 1.02 square: P$1 16.5,1.5 | drill 0.8 pad 1.02: P$2 13.5,1.5; P$3 10.5,1.5; P$4 7.5,1.5; P$5 4.5,1.5; P$6 1.5,1.5; P$7 -1.5,1.5; P$8 -4.5,1.5; P$9 -7.5,1.5; P$10 -10.5,1.5; P$11 -13.5,1.5; P$12 -16.5,1.5; P$13 16.5,4.5; P$14 13.5,4.5; P$15 10.5,4.5; P$16 7.5,4.5; P$17 4.5,4.5; P$18 1.5,4.5; P$19 -1.5,4.5; P$20 -4.5,4.5; P$21 -7.5,4.5; P$22 -10.5,4.5; P$23 -13.5,4.5; P$24 -16.5,4.5 | hole 3: -14.35,-2.82; 14.35,-2.82
24-SOIC = smd 0.6 x 2: P$1 -6.985,-4.7; P$2 -5.715,-4.7; P$3 -4.445,-4.7; P$4 -3.175,-4.7; P$5 -1.905,-4.7; P$6 -0.635,-4.7; P$7 0.635,-4.7; P$8 1.905,-4.7; P$9 3.175,-4.7; P$10 4.445,-4.7; P$11 5.715,-4.7; P$12 6.985,-4.7; P$13 6.985,4.7; P$14 5.715,4.7; P$15 4.445,4.7; P$16 3.175,4.7; P$17 1.905,4.7; P$18 0.635,4.7; P$19 -0.635,4.7; P$20 -1.905,4.7; P$21 -3.175,4.7; P$22 -4.445,4.7; P$23 -5.715,4.7; P$24 -6.985,4.7
CHIPLED_0805 = smd 1.2 x 1.2: A 0,-1.05; C 0,1.05
4_PIN_MOLEX = drill 1.8 square: P$1 2.1,-2.25 | drill 1.8: P$2 2.1,2.25; P$3 -2.1,-2.25; P$4 -2.1,2.25 | hole 3: 0,-9.55

### Placement (x,y rotation side)
C1  10.16,30.48 0 bottom
C2  25.4,38.1 270 bottom
C3  117.16,32.7 270 top
C4  -12.7,-574.04 0 top  (outside the outline)
C5  -12.7,-580.39 0 top  (outside the outline)
C6  -12.7,-586.74 0 top  (outside the outline)
C7  -12.7,-593.09 0 top  (outside the outline)
C8  -12.7,-599.44 0 top  (outside the outline)
C9  -12.7,-609.6 0 top  (outside the outline)
C15  132.72,33.97 90 top
C16  13.97,34.29 180 bottom
D1  19.05,29.21 0 bottom
D2  106.68,38.1 180 top
D3  -11.43,-604.52 0 top  (outside the outline)
H7  108.27,32.38 180 bottom
IC1  35.56,30.48 225 bottom
IC2  12.7,25.4 270 bottom
IC3  127,34.29 90 bottom
L1  107.95,24.13 180 bottom
Q1  13.97,39.37 180 bottom
R1  17.78,33.02 180 bottom
R3  114.62,37.15 180 bottom
R4  -12.7,-262.89 0 top  (outside the outline)
R5  -12.7,-71.12 0 top  (outside the outline)
R6  119.38,38.1 0 bottom
R10  -12.7,-77.47 0 top  (outside the outline)
R11  -12.7,-83.82 0 top  (outside the outline)
R12  -12.7,-90.17 0 top  (outside the outline)
R13  -12.7,-96.52 0 top  (outside the outline)
R14  -7.62,-96.52 0 top  (outside the outline)
R15  -12.7,-102.87 0 top  (outside the outline)
R16  -7.62,-102.87 0 top  (outside the outline)
R17  -12.7,-109.22 0 top  (outside the outline)
R18  -7.62,-109.22 0 top  (outside the outline)
R19  -12.7,-115.57 0 top  (outside the outline)
R20  -7.62,-115.57 0 top  (outside the outline)
R21  -12.7,-121.92 0 top  (outside the outline)
R22  -7.62,-121.92 0 top  (outside the outline)
R23  -2.54,-121.92 0 top  (outside the outline)
R24  -12.7,-128.27 0 top  (outside the outline)
R25  -7.62,-128.27 0 top  (outside the outline)
R26  -2.54,-128.27 0 top  (outside the outline)
R27  -12.7,-134.62 0 top  (outside the outline)
R28  -7.62,-134.62 0 top  (outside the outline)
R29  -2.54,-134.62 0 top  (outside the outline)
R30  -12.7,-140.97 0 top  (outside the outline)
R31  -7.62,-140.97 0 top  (outside the outline)
R32  -2.54,-140.97 0 top  (outside the outline)
R33  -12.7,-269.24 0 top  (outside the outline)
R34  -12.7,-275.59 0 top  (outside the outline)
R35  -12.7,-281.94 0 top  (outside the outline)
R36  -12.7,-288.29 0 top  (outside the outline)
R37  -12.7,-294.64 0 top  (outside the outline)
R38  -12.7,-300.99 0 top  (outside the outline)
R39  -12.7,-307.34 0 top  (outside the outline)
R40  -12.7,-313.69 0 top  (outside the outline)
R41  -12.7,-320.04 0 top  (outside the outline)
R42  -12.7,-326.39 0 top  (outside the outline)
R43  -12.7,-332.74 0 top  (outside the outline)
R44  -12.7,-339.09 0 top  (outside the outline)
R45  -12.7,-345.44 0 top  (outside the outline)
R46  -12.7,-351.79 0 top  (outside the outline)
R47  -12.7,-358.14 0 top  (outside the outline)
R48  -12.7,-364.49 0 top  (outside the outline)
R49  -12.7,-370.84 0 top  (outside the outline)
R50  -12.7,-377.19 0 top  (outside the outline)
R51  -12.7,-383.54 0 top  (outside the outline)
R52  -12.7,-389.89 0 top  (outside the outline)
R53  -12.7,-396.24 0 top  (outside the outline)
R54  -12.7,-402.59 0 top  (outside the outline)
R55  -12.7,-408.94 0 top  (outside the outline)
R56  -12.7,-415.29 0 top  (outside the outline)
R57  -12.7,-421.64 0 top  (outside the outline)
R58  -12.7,-427.99 0 top  (outside the outline)
R59  -12.7,-434.34 0 top  (outside the outline)
R60  -12.7,-440.69 0 top  (outside the outline)
R61  -12.7,-447.04 0 top  (outside the outline)
R62  -12.7,-453.39 0 top  (outside the outline)
R63  -12.7,-459.74 0 top  (outside the outline)
R64  -12.7,-466.09 0 top  (outside the outline)
R65  -12.7,-472.44 0 top  (outside the outline)
R66  -12.7,-478.79 0 top  (outside the outline)
R67  -12.7,-485.14 0 top  (outside the outline)
R68  -12.7,-491.49 0 top  (outside the outline)
R69  -12.7,-497.84 0 top  (outside the outline)
R70  -12.7,-504.19 0 top  (outside the outline)
R71  -12.7,-510.54 0 top  (outside the outline)
R72  -12.7,-516.89 0 top  (outside the outline)
R73  -12.7,-523.24 0 top  (outside the outline)
R74  -12.7,-529.59 0 top  (outside the outline)
R75  -12.7,-535.94 0 top  (outside the outline)
R76  -12.7,-542.29 0 top  (outside the outline)
R77  -12.7,-548.64 0 top  (outside the outline)
R78  -12.7,-554.99 0 top  (outside the outline)
R79  -12.7,-561.34 0 top  (outside the outline)
SJ1  13.97,31.75 0 bottom
U1  -11.43,-568.96 0 top  (outside the outline)
U$1  124.46,33.02 0 top
U$2  25.4,48.26 180 top
U$3  69.85,48.26 180 top
U$4  19.05,31.75 180 top
U$5  50.8,29.21 90 top
U$6  66.04,29.21 90 top
U$7  80.01,29.21 90 top
U$8  93.98,29.21 90 top
U$9  114.3,48.26 180 top
U$10  115.57,10.16 0 top
U$11  69.85,10.16 0 top
U$12  24.13,10.16 0 top
VCC!  129.54,38.1 90 bottom
X1  140.97,38.1 180 top

### Tracks (layer width: path | path; a pad name or v marks a point on that pad's centre or on a via)
12V  (3 unrouted)
AIN0  (2 unrouted)
AIN1  (2 unrouted)
AIN2  (2 unrouted)
AIN3  (2 unrouted)
AIN4  (2 unrouted)
AIN5  (2 unrouted)
AIN6  (2 unrouted)
AIN7  (2 unrouted)
AIN8  (2 unrouted)
AIN9  (2 unrouted)
AIN10  (2 unrouted)
AIN11  (3 unrouted)
AIN12  (1 unrouted)
AIN13  (2 unrouted)
AIN14  (2 unrouted)
AIN15  (2 unrouted)
AIN16  (2 unrouted)
AIN17  (2 unrouted)
AIN18  (2 unrouted)
AIN19  (2 unrouted)
AIN20  (2 unrouted)
AIN21  (2 unrouted)
AIN22  (2 unrouted)
AIN23  (2 unrouted)
AIN24  (2 unrouted)
AIN25  (2 unrouted)
AIN26  (2 unrouted)
AIN27  (2 unrouted)
AIN28  (2 unrouted)
AIN29  (2 unrouted)
AIN30  (2 unrouted)
AIN31  (2 unrouted)
AIN32  (2 unrouted)
AIN33  (2 unrouted)
AIN34  (2 unrouted)
AIN35  (2 unrouted)
AIN36  (2 unrouted)
AIN37  (2 unrouted)
AIN38  (2 unrouted)
AIN39  (2 unrouted)
AIN40  (2 unrouted)
AIN41  (2 unrouted)
AIN42  (2 unrouted)
AIN43  (2 unrouted)
AIN44  (2 unrouted)
AIN45  (2 unrouted)
AIN46  (2 unrouted)
AIN47  (2 unrouted)
AIN48  (2 unrouted)
AIN49  (2 unrouted)
AIN50  (2 unrouted)
AIN51  (2 unrouted)
AIN52  (2 unrouted)
AIN53  (2 unrouted)
AIN54  (2 unrouted)
AIN55  (2 unrouted)
AIN56  (2 unrouted)
AIN57  (2 unrouted)
AIN58  (2 unrouted)
AIN59  (2 unrouted)
AIN60  (2 unrouted)
AIN61  (2 unrouted)
AIN62  (2 unrouted)
AIN63  (2 unrouted)
AIN64  (2 unrouted)
AIN65  (2 unrouted)
AIN66  (2 unrouted)
AIN67  (2 unrouted)
AIN68  (2 unrouted)
AIN69  (2 unrouted)
AIN70  (2 unrouted)
AIN71  (2 unrouted)
AVR_SCK  (1 unrouted)
CAN_H  (2 unrouted)
CAN_L  (2 unrouted)
GND  (via drill 0.6)  (259 unrouted)
  Top 0.406: C3.2 118.79,30.12 U$1.P$1
  other vias: 2.54,20.32 2.54,17.78 2.54,15.24 2.54,12.7 2.54,10.16 2.54,7.62 2.54,5.08 2.54,2.54 5.08,2.54 7.62,2.54 10.16,2.54 12.7,2.54 15.24,2.54 17.78,2.54 20.32,2.54 22.86,2.54 25.4,2.54 27.94,2.54 30.48,2.54 33.02,2.54 35.56,2.54 38.1,2.54 40.64,2.54 43.18,2.54 45.72,2.54 48.26,2.54 50.8,2.54 53.34,2.54 55.88,2.54 58.42,2.54 147.32,20.32 147.32,17.78 147.32,15.24 147.32,12.7 147.32,10.16 147.32,7.62 147.32,5.08 147.32,2.54 45.72,55.88 48.26,55.88 50.8,55.88 53.34,55.88 55.88,55.88 58.42,55.88 60.96,55.88 63.5,55.88 66.04,55.88 68.58,55.88 71.12,55.88 73.66,55.88 76.2,55.88 78.74,55.88 81.28,55.88 83.82,55.88 86.36,55.88 88.9,55.88 91.44,55.88 93.98,55.88 96.52,55.88 147.32,55.88 2.54,55.88 5.08,55.88 7.62,55.88 10.16,55.88 12.7,55.88 15.24,55.88 17.78,55.88 20.32,55.88 22.86,55.88 25.4,55.88 27.94,55.88 30.48,55.88 33.02,55.88 35.56,55.88 38.1,55.88 40.64,55.88 43.18,55.88 60.96,2.54 63.5,2.54 66.04,2.54 68.58,2.54 71.12,2.54 73.66,2.54 76.2,2.54 78.74,2.54 81.28,2.54 83.82,2.54 86.36,2.54 88.9,2.54 91.44,2.54 93.98,2.54 99.06,2.54 96.52,2.54 99.06,55.88 101.6,55.88 104.14,55.88 106.68,55.88 109.22,55.88 111.76,55.88 114.3,55.88 116.84,55.88 119.38,55.88 121.92,55.88 124.46,55.88 127,55.88 129.54,55.88 132.08,55.88 134.62,55.88 101.6,2.54 104.14,2.54 106.68,2.54 109.22,2.54 111.76,2.54 114.3,2.54 116.84,2.54 119.38,2.54 121.92,2.54 124.46,2.54 127,2.54 129.54,2.54 132.08,2.54 134.62,2.54 147.32,53.34 147.32,50.8 147.32,48.26 147.32,45.72 147.32,43.18 147.32,40.64 147.32,38.1 147.32,35.56 147.32,33.02 147.32,30.48 147.32,27.94 147.32,25.4 147.32,22.86 2.54,53.34 2.54,50.8 2.54,48.26 2.54,45.72 2.54,43.18 2.54,40.64 2.54,38.1 2.54,35.56 2.54,33.02 2.54,30.48 2.54,27.94 2.54,25.4 2.54,22.86
  pour Top (isolate 0.305, rank 6): 0,0 150.16,0 150.16,58.42 0,58.42
  pour Bottom (isolate 0.305, rank 6): 0,0 150.16,0 150.16,58.42 0,58.42
N$1  (1 unrouted)
  Top 0.406: C15.1 129.54,31.15 U$1.P$3
N$2  (1 unrouted)
N$6  (1 unrouted)
N$9  (1 unrouted)
N$11  (via drill 0.6)  (4 unrouted)
  Bottom 0.305: Q1.1 v8.57,34.99 C1.2
N$22  (1 unrouted)
OUT0  (1 unrouted)
OUT1  (1 unrouted)
OUT2  (1 unrouted)
OUT3  (1 unrouted)
OUT4  (1 unrouted)
RESET  (5 unrouted)
RX  (1 unrouted)
RXCAN  (1 unrouted)
S0  (5 unrouted)
S1  (5 unrouted)
S2  (5 unrouted)
S3  (5 unrouted)
TX  (1 unrouted)
TXCAN  (1 unrouted)
VCC  (via drill 0.6)  (126 unrouted)
  other vias: 119.38,38.1 120.65,38.1 121.92,38.1 119.38,36.83 120.65,36.83 121.92,36.83 121.92,35.56 120.65,35.56 119.38,35.56 128.27,38.1 129.54,38.1 129.54,36.83 128.27,36.83 125.73,38.1 127,38.1 123.19,38.1 124.46,38.1 119.38,34.29 120.65,34.29 119.38,33.02 120.65,33.02 121.92,33.02 123.19,33.02 124.46,33.02 125.73,33.02 127,33.02 128.27,33.02 129.54,33.02 129.54,34.29 127,34.29 128.27,34.29 127,35.56 127,36.83 128.27,35.56 129.54,35.56 124.46,27.94 125.73,27.94 124.46,26.67
  pour Top (isolate 0.305): 115.57,38.1 129.54,38.1 129.54,26.67 115.57,26.67
  pour Bottom (isolate 0.305): 115.57,26.67 129.54,26.67 129.54,38.1 115.57,38.1
XTAL1  (via drill 0.6)  (3 unrouted)
  Bottom 0.305: Q1.2 v22.93,39.69 C2.2